# EAGLE design Braumister (EAGLE 5.11)
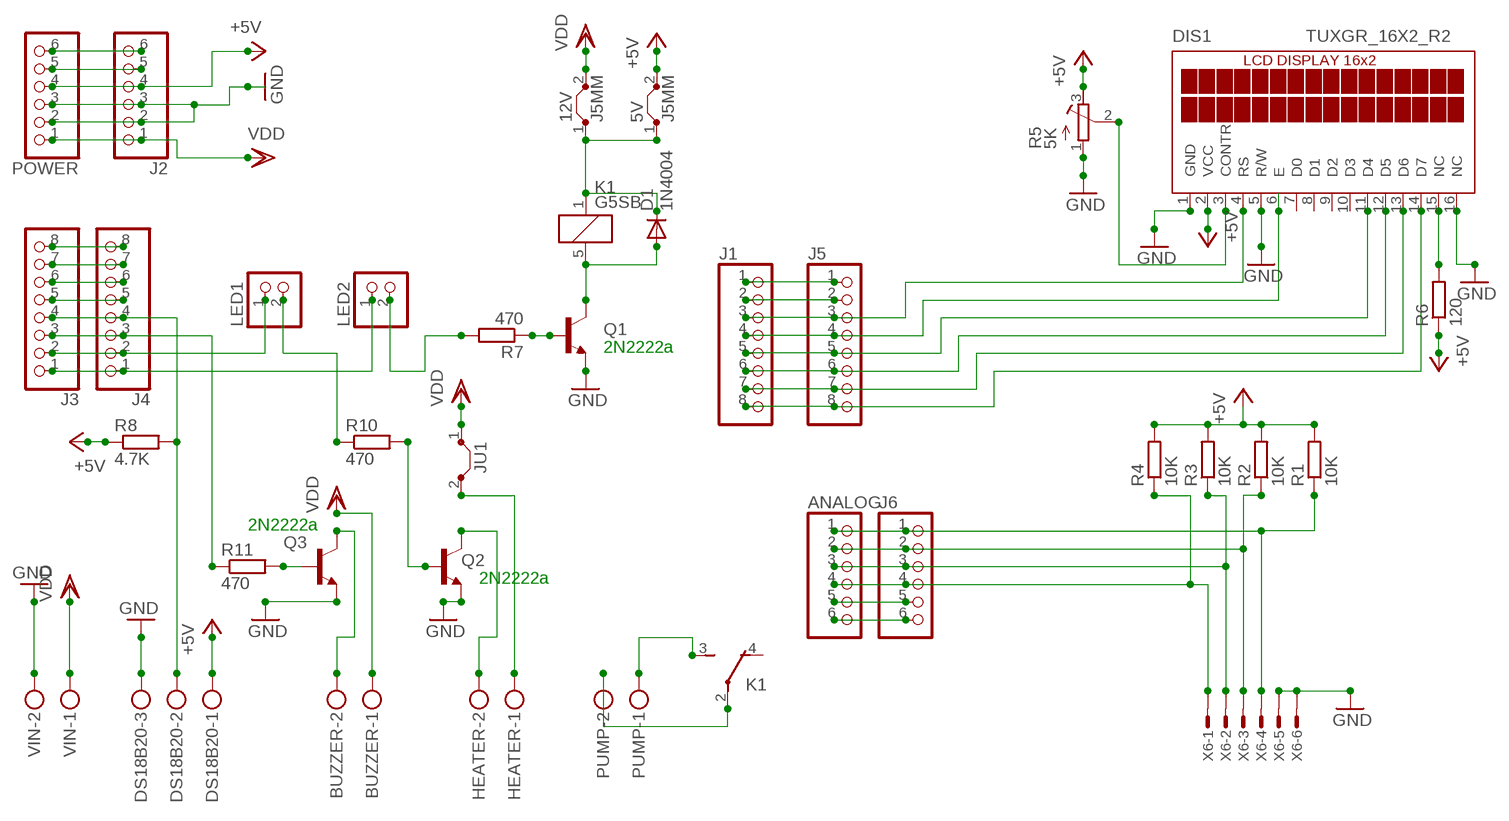
[diagram p0: schematic, sheet 1]

## Parts
5V  J5MM  [05]
12V  J5MM  [05]
ANALOG  PINHD-1X6NOVAULE  [1X06_NOVALUE]
BUZZER  MKDSN1,5/2-5,08  [MKDSN1,5/2-5,08]
D1  1N4004  [DO41-10]
DIS1  TUXGR_16X2_R2  [TUXGR_16X2_R2]
DS18B20  MKDSN1,5/3-5,08  [MKDSN1,5/3-5,08]
HEATER  MKDSN1,5/2-5,08  [MKDSN1,5/2-5,08]
J1  PINHD-1X8  [1X08]
J2  PINHD-1X6NOVAULE  [1X06_NOVALUE]
J3  PINHD-1X8  [1X08]
J4  PINHD-1X8  [1X08]
J5  PINHD-1X8  [1X08]
J6  PINHD-1X6  [1X06]
JU1  J10MM  [10]
K1  G5SB  [G5SB]
LED1  PINHD-1X2  [1X02]
LED2  PINHD-1X2  [1X02]
POWER  PINHD-1X6  [1X06]
PUMP  MKDSN1,5/2-5,08  [MKDSN1,5/2-5,08]
Q1  BC547  [TO92]
Q2  BC547  [TO92]
Q3  BC547  [TO92]
R1  10K  R-EU_0207/10  [0207/10]
R2  10K  R-EU_0207/10  [0207/10]
R3  10K  R-EU_0207/10  [0207/10]
R4  10K  R-EU_0207/10  [0207/10]
R5  5K  R-TRIMM3339P  [RTRIM3339P]
R6  120  R-EU_0207/10  [0207/10]
R7  470  R-EU_0207/10  [0207/10]
R8  4.7K  R-EU_0207/10  [0207/10]
R10  470  R-EU_0207/10  [0207/10]
R11  470  R-EU_0207/10  [0207/10]
VIN  MKDSN1,5/2-5,08  [MKDSN1,5/2-5,08]
X6  MICROMATCH-6  [MICROMATCH-6]

## Nets
+5V: 5V.2 DIS1.2(VCC) DS18B20.1 J2.4 POWER.4 R1.2 R2.2 R3.2 R4.2 R5.3(A) R6.1 R8.1
GND: DIS1.1(GND) DIS1.5(R/W) DIS1.16(NC) DS18B20.3 J2.2 J2.3 POWER.2 POWER.3 Q1.1(E) Q2.1(E) Q3.1(E) R5.1(E) VIN.2 X6.5 X6.6
N$1: J3.1 J4.1 LED2.1
N$2: J3.5 J4.5
N$3: ANALOG.1 J6.1 R1.1 X6.4
N$4: HEATER.2 Q2.3(C)
N$5: DS18B20.2 J3.4 J4.4 R8.2
N$6: J3.2 J4.2 LED1.1
N$7: J3.3 J4.3 R11.1
N$8: J1.1 J5.1
N$9: J1.2 J5.2
N$10: DIS1.4(RS) J1.3 J5.3
N$11: DIS1.6(E) J1.4 J5.4
N$12: DIS1.11(D4) J1.5 J5.5
N$13: DIS1.12(D5) J1.6 J5.6
N$14: DIS1.13(D6) J1.7 J5.7
N$15: DIS1.14(D7) J1.8 J5.8
N$16: ANALOG.2 J6.2 R2.1 X6.3
N$17: J3.6 J4.6
N$18: ANALOG.3 J6.3 R3.1 X6.2
N$19: ANALOG.4 J6.4 R4.1 X6.1
N$20: ANALOG.5 J6.5
N$21: ANALOG.6 J6.6
N$22: J3.7 J4.7
N$23: J3.8 J4.8
N$24: J2.5 POWER.5
N$25: J2.6 POWER.6
N$26: 5V.1 12V.1 D1.C K1.1
N$35: DIS1.3(CONTR) R5.2(S)
N$36: DIS1.15(NC) R6.2
N$38: K1.3(U:S) PUMP.1
N$39: K1.2(U:P) PUMP.2
N$40: D1.A K1.5 Q1.3(C)
N$43: Q1.2(B) R7.1
N$44: LED2.2 R7.2
N$45: HEATER.1 JU1.2
N$46: Q3.2(B) R11.2
N$47: BUZZER.2 Q3.3(C)
N$49: Q2.2(B) R10.2
N$50: LED1.2 R10.1
VDD: 12V.2 BUZZER.1 J2.1 JU1.1 POWER.1 VIN.1
Unconnected: DIS1.7(D0) DIS1.8(D1) DIS1.9(D2) DIS1.10(D3) K1.4(U:O)

## Notes on the sheet
- 2N2222a
- 2N2222a
- 2N2222a

## Library data of the parts
5V 12V JU1 = jumper:J: Bridge
ANALOG J2 J6 POWER = pinhead_arduino:PINHD-1X6: PIN HEADER
BUZZER HEATER PUMP VIN = con-phoenix-508:MKDSN1,5/2-5,08: MKDSN 1,5/ 2-5,08 Printklemme Nennstrom: 13,5 A Nennspannung: 250 V Rastermaß: 5,08 mm Polzahl: 2 Anschlussart: Schraubanschluss Montage: Löten Anschlussrichtung Leiter/Platine: 0 ° Artikelnummer: 1729128 Source: http://eshop.phoenixcontact.com .. 1729128.pdf; MPN: MKDSN 1,5/2-5.08; OC_FARNELL: 1792903; OC_NEWARK: 30M2397
D1 = diode:1N4004: DIODE general purpose rectifier, 1 A
DIS1 = display-lcd:TUXGR_16X2_R2: Tuxgraphics LCD display 16x2 characters reflective, without background light Source: tuxgr_12x2_r2.pdf; OC_FARNELL: unknown; OC_NEWARK: unknown
DS18B20 = con-phoenix-508:MKDSN1,5/3-5,08: MKDSN 1,5/ 3-5,08 Printklemme Nennstrom: 13,5 A Nennspannung: 250 V Rastermaß: 5,08 mm Polzahl: 3 Anschlussart: Schraubanschluss Montage: Löten Anschlussrichtung Leiter/Platine: 0 ° Artikelnummer: 1729131 Source: http://eshop.phoenixcontact.com .. 1729131.pdf; MPN: SMKDSN1,5/3-5,08; OC_FARNELL: 1792904; OC_NEWARK: 70R0299
J1 J3-J5 = pinhead_arduino:PINHD-1X8: PIN HEADER
K1 = relay_arduino:G5SB: Compact Single-pole Relay for Switching 5 A Source: http://www.omron.com/ecb/products/pry/121/g5sb.html; OC_FARNELL: unknown; OC_NEWARK: unknown
LED1 LED2 = pinhead_arduino:PINHD-1X2: PIN HEADER
Q1-Q3 = transistor-npn:BC547*: NPN Transistor
R1-R4 R6-R8 R10 R11 = rcl:R-EU_: RESISTOR, European symbol
R5 = rcl:R-TRIMM: Trimm resistor
X6 = con-amp-micromatch1:MICROMATCH-6: MicroMaTch 6 7-215464-6 / 0-215464-6 Drawing Number C-215464 DDEController.pdf

## Board
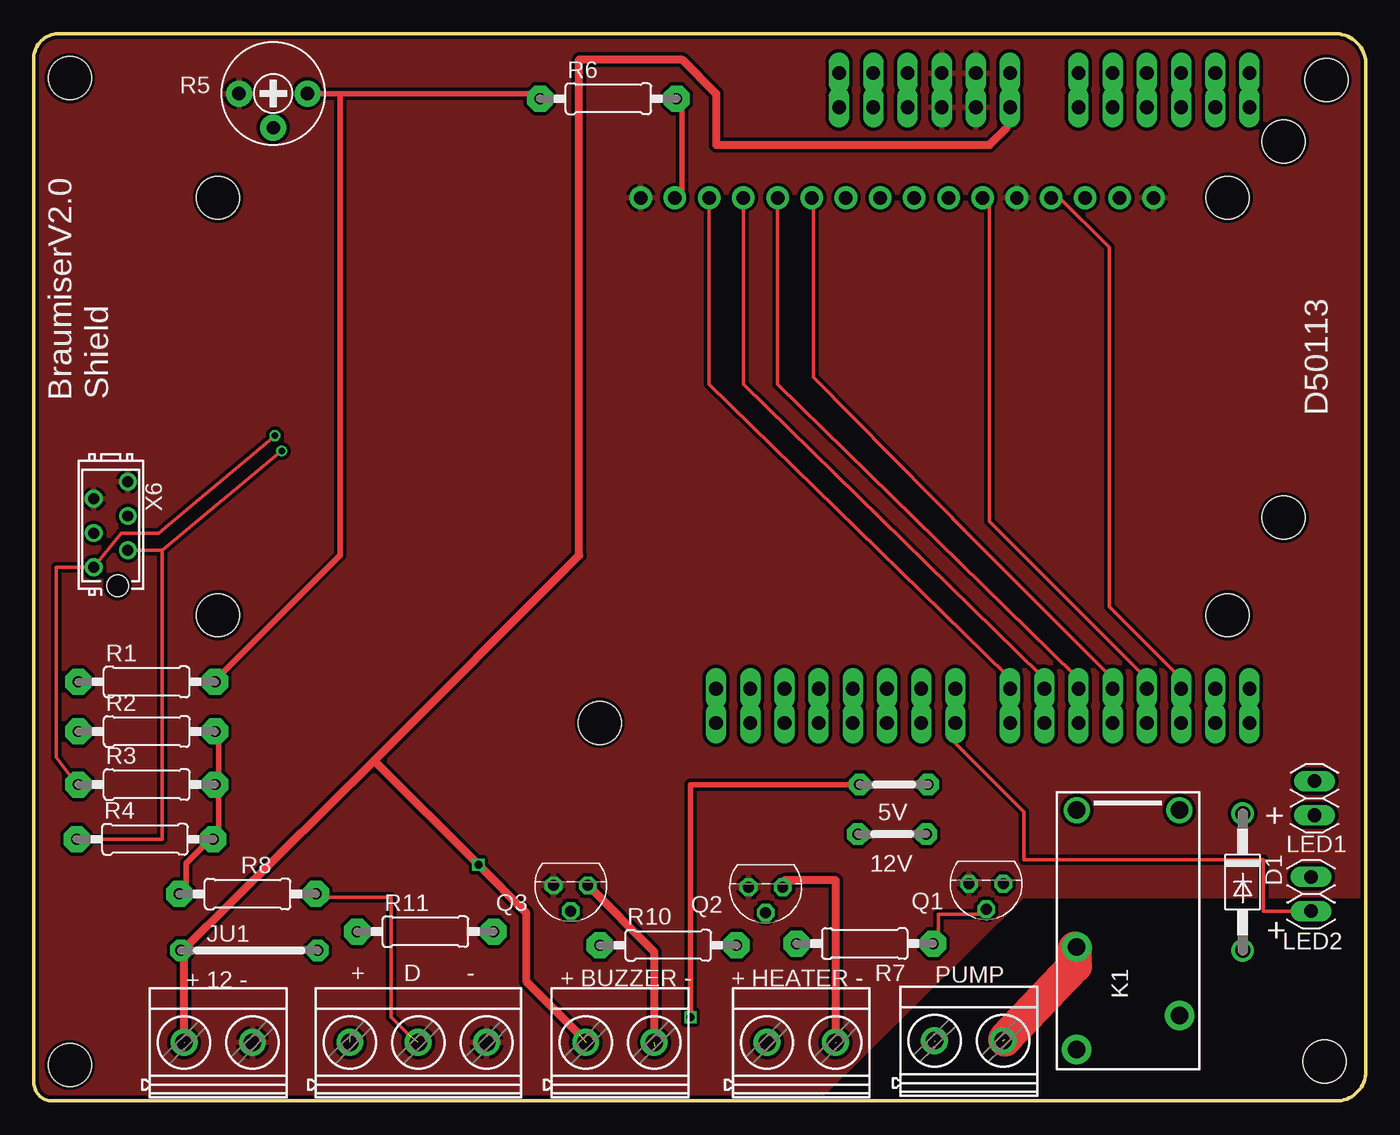
[diagram p1: board, top side]
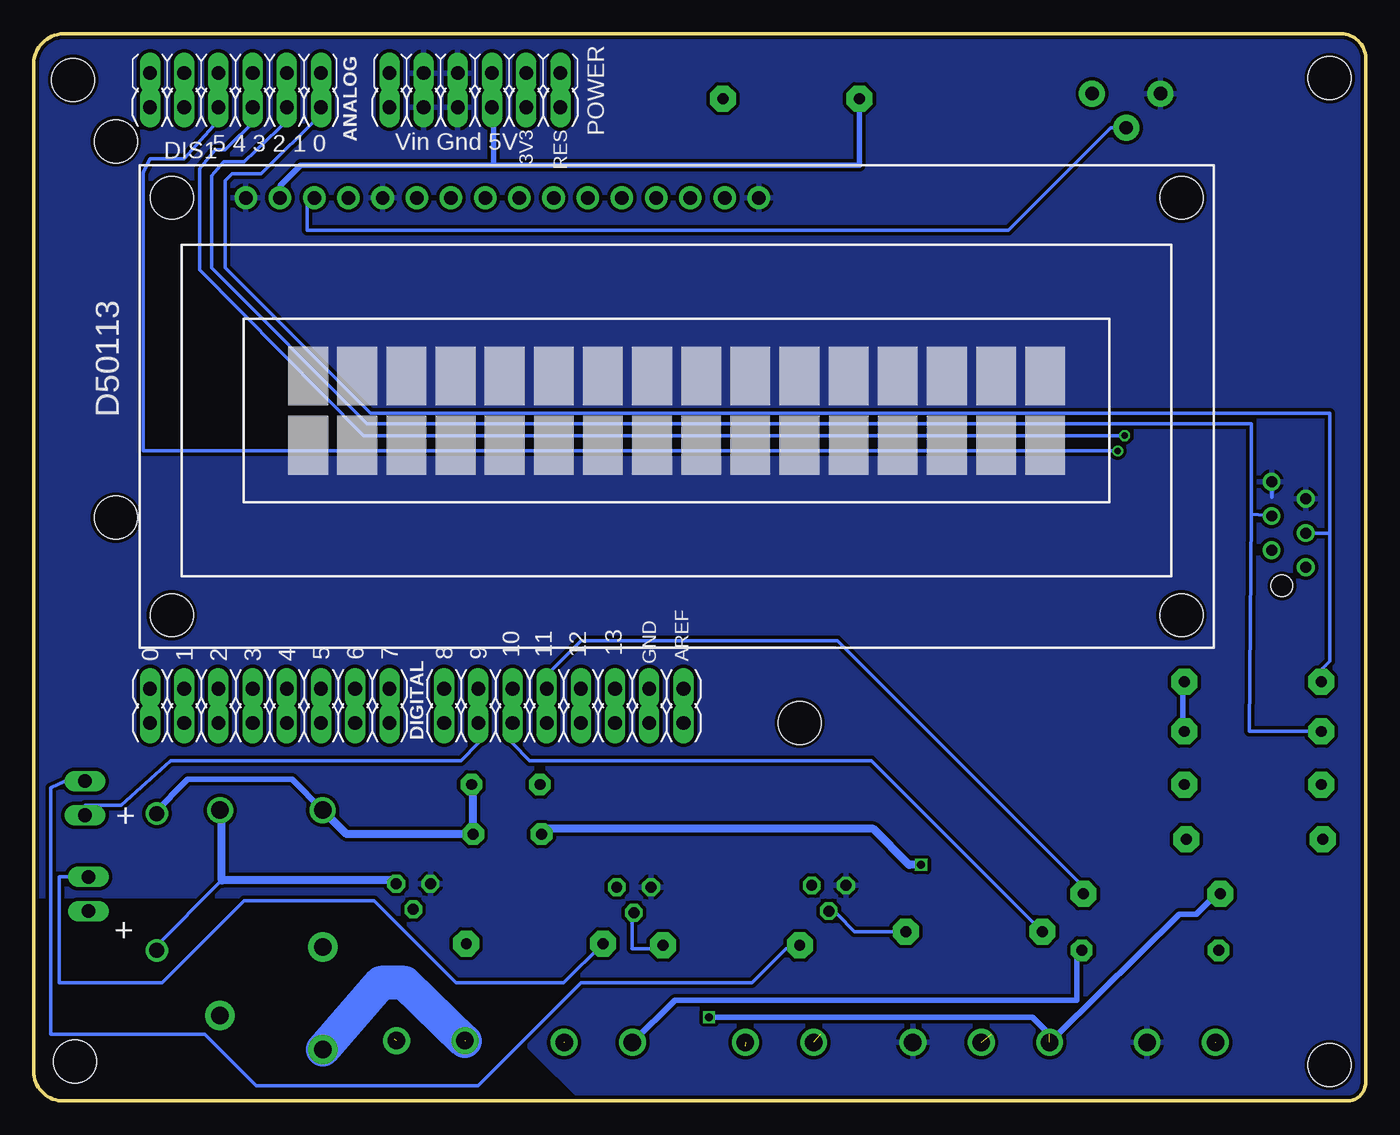
[diagram p2: board, bottom side, seen from below]

Size 98.96 x 79.25 mm. Coordinates in mm from the lower left corner, seen from the top.
Outline: 1.65,79.25 arc90 0.02,77.11 0.02,1.26 arc90 1.52,0.01 96.93,0.01 arc90 98.95,2.4 98.95,76.84 arc90 96.79,79.25 1.67,79.25
Copper layers (1*16): Top 0.035mm / dielectric 1.5mm / Bottom 0.035mm
Design rules "Fusion_eagle_rule_v1.1 *": minimum track width 6mil, minimum drill 12mil, track to track 10mil, track to pad 10mil, pad to pad 10mil, via to via 10mil, smd to smd 0mil, copper to edge 10mil, drill to drill 10mil, minimum pad ring 10mil, minimum via ring 6mil, stop-mask expansion 2mil, vias tented up to drill 100mil, thermal gap 10mil
Holes 3.2 mm at 42.05,28.07 92.85,71.25 92.85,43.31 2.68,75.95 96.03,75.82 2.68,2.67 95.9,2.93

### Footprints (pad centres in the part's own frame; a part is rotated, then mirrored left to right if it is on the bottom)
05 = drill 0.813 pad 1.6 octagon: 1 -2.54,0; 2 2.54,0
1X06_NOVALUE = drill 1.016 long: 1 -6.35,0; 2 -3.81,0; 3 -1.27,0; 4 1.27,0; 5 3.81,0; 6 6.35,0
MKDSN1,5/2-5,08 = drill 1.3 pad 2 round: 1 -2.561,0.025; 2 2.519,0.025
DO41-10 = drill 1.118 round: A 5.08,0; C -5.08,0
TUXGR_16X2_R2 = drill 1 pad 1.676 round: 1 -32,15.5; 2 -29.46,15.5; 3 -26.92,15.5; 4 -24.38,15.5; 5 -21.84,15.5; 6 -19.3,15.5; 7 -16.76,15.5; 8 -14.22,15.5; 9 -11.68,15.5; 10 -9.14,15.5; 11 -6.6,15.5; 12 -4.06,15.5; 13 -1.52,15.5; 14 1.02,15.5; 15 3.56,15.5; 16 6.1,15.5 | hole 3.2: -37.5,-15.5; 37.5,-15.5; -37.5,15.5; 37.5,15.5
MKDSN1,5/3-5,08 = drill 1.3 pad 2 round: 1 -7.641,0.025; 2 -2.561,0.025; 3 2.519,0.025
1X08 = drill 1.016 long: 1 -8.89,0; 2 -6.35,0; 3 -3.81,0; 4 -1.27,0; 5 1.27,0; 6 3.81,0; 7 6.35,0; 8 8.89,0
1X06 = drill 1.016 long: 1 -6.35,0; 2 -3.81,0; 3 -1.27,0; 4 1.27,0; 5 3.81,0; 6 6.35,0
10 = drill 0.813 pad 1.6 octagon: 1 -5.08,0; 2 5.08,0
G5SB = drill 1.3 pad 1.93 round: 1 7.62,3.81; 5 7.62,-3.81 | drill 1.3 pad 2.184 round: 2 -2.54,3.81; 3 -10.16,3.81; 4 -7.62,-3.81
1X02 = drill 1.016 long: 1 -1.27,0; 2 1.27,0
TO92 = drill 0.813 octagon: 1 1.27,0; 2 0,1.905; 3 -1.27,0
0207/10 = drill 0.813 pad 1.93 octagon: 1 -5.08,0; 2 5.08,0
RTRIM3339P = drill 1 pad 1.93 round: 1 -2.54,0; 2 0,-2.54; 3 2.54,0
MICROMATCH-6 = drill 0.813 round: 1 1.905,1.27; 2 3.175,-1.27; 3 -0.635,1.27; 4 0.635,-1.27; 5 -3.175,1.27; 6 -1.905,-1.27 | hole 1.6: 4.55,0.5

### Placement (x,y rotation side)
5V  63.9,23.5 180 top
12V  63.77,19.82 180 top
ANALOG  83.96,76.33 180 bottom
BUZZER  43.58,4.32 0 top
D1  89.8,16.26 270 top
DIS1  51.2,51.57 0 bottom
DS18B20  31.13,4.32 0 top
HEATER  57.04,4.32 0 top
J1  81.42,28.07 0 bottom
J2  66.18,76.33 0 bottom
J3  59.58,28.07 0 bottom
J4  59.58,30.61 0 bottom
J5  81.42,30.61 0 bottom
J6  83.96,73.79 180 bottom
JU1  16.02,11.18 0 top
K1  81.3,13.98 90 top
LED1  95.14,22.48 90 top
LED2  94.88,15.37 90 top
POWER  66.18,73.79 0 bottom
PUMP  69.48,4.45 0 top
Q1  70.75,16.13 180 top
Q2  54.37,15.88 180 top
Q3  39.89,16.01 180 top
R1  8.4,31.12 0 top
R2  8.4,27.44 0 top
R3  8.4,23.5 0 top
R4  8.27,19.44 0 top
R5  17.8,74.81 0 top
R6  42.69,74.43 0 top
R7  61.74,11.69 180 top
R8  15.89,15.37 0 top
R10  47.13,11.56 0 top
R11  29.1,12.58 0 top
VIN  13.73,4.32 0 top
X6  5.73,42.8 270 top

### Tracks (layer width: path | path; a pad name or v marks a point on that pad's centre or on a via)
+5V  (via drill 0.6)  (1 unrouted)
  Top 0.254: R8.1 11.32,15.12 | 13.73,22.87 R3.2 13.73,24.01 | 12.59,18.93 R4.2 | 13.73,26.55 R2.2 | 36.72,74.81 R6.1 | R5.3 20.21,74.81 | R1.2 13.86,31.63
  Top 0.406: 11.32,15.12 11.32,17.66 12.59,18.93 13.73,19.69 13.73,22.87 | 13.73,24.01 13.73,26.55 | 22.75,74.81 R5.3 | 22.75,74.81 36.72,74.81 | 13.86,31.63 22.75,40.52 22.75,74.81 | v48.78,6.23 48.78,23.5 5V.2
  Bottom 0.254: 13.6,30.49 13.86,30.36 R1.2 | R2.2 13.6,27.95 | R8.1 11.32,15.12 | 64.66,74.81 64.66,76.08 J2.4 | 64.66,74.81 POWER.4 64.79,73.67 64.79,69.6 64.91,69.47 | 80.66,67.95 DIS1.2 | 64.79,74.81 64.66,74.81
  Bottom 0.406: 13.6,27.95 13.6,30.49 | 11.32,15.12 12.59,13.85 13.86,13.85 22.88,4.96 23.51,4.96 24.78,6.23 v48.78,6.23 | 80.66,67.95 79.14,69.47 64.91,69.47 | 64.79,74.81 64.79,69.47 37.61,69.47 R6.1
GND
  Bottom 0.254: 7,44.84 X6.5
  pour Top: 8.14,79.51 98.82,79.51 98.82,15.25 73.42,15.25 58.05,0.01 -0.11,0.01 -0.11,79.38 8.14,79.38
  pour Bottom: 7.38,79.13 98.82,79.38 98.82,15.25 73.42,15.25 58.05,0.01 0.02,0.01 0.02,79.25 7.38,79.25
N$1
  Top 0.254: J4.1 J3.1 68.47,26.55 73.55,21.47 73.55,17.91 91.33,17.91 91.33,14.1 LED2.1
N$2
  Top 0.254: J3.5 J4.5
N$3
  Top 0.254: J6.1 77.36,74.81 77.36,76.08 ANALOG.1
  Bottom 0.254: R1.1 3.32,32.01 2.68,32.64 2.68,42.17 | 2.68,42.17 X6.4 | 2.68,42.17 2.68,51.06 73.93,51.06 84.72,61.85 84.72,68.33 84.22,68.84 82.06,68.84 77.61,73.28 J6.1
N$4  (1 unrouted)
  Top 0.254: 55.77,16.39 Q2.3 | 59.58,4.32 59.58,4.96
  Top 0.61: 55.77,16.39 59.58,16.39 59.58,4.96
N$5  (1 unrouted)
  Top 0.254: J4.4 J3.4 | 27.83,4.96 26.56,6.23 26.56,15.12 21.48,15.12 R8.2
  Bottom 0.254: J4.4 60.85,31.63 58.31,34.17 39.26,34.17 20.21,15.12 R8.2
N$6
  Top 0.254: J3.2 J4.2
  Bottom 0.254: LED1.1 95.14,21.98 92.47,21.98 88.79,25.28 67.2,25.28 65.93,26.55 J3.2
N$7
  Top 0.254: J3.3 J4.3
  Bottom 0.254: R11.1 36.72,25.28 62.12,25.28 63.39,26.55 J3.3
N$8
  Top 0.254: J1.1 90.06,29.09 90.06,30.36 J5.1
N$9
  Top 0.254: J1.2 87.52,29.09 87.52,30.36 J5.2
N$10
  Top 0.254: J1.3 84.98,29.09 84.98,30.36 J5.3 84.98,31.63 79.9,36.71 79.9,63.38 76.09,67.19 DIS1.4
N$11
  Top 0.254: J1.4 82.44,29.09 82.44,30.36 J5.4 82.44,31.63 71.01,43.06 71.01,67.19 DIS1.6
N$12
  Top 0.254: J1.5 79.9,29.09 79.9,30.36 J5.5 79.9,31.63 69.74,41.79 57.93,53.73 57.93,67.19 DIS1.11
N$13
  Top 0.254: J1.6 77.36,29.09 77.36,30.36 J5.6 77.36,31.63 55.26,53.22 55.26,67.19 DIS1.12
N$14
  Top 0.254: J1.7 74.82,29.09 74.82,30.36 J5.7 74.82,31.63 52.72,53.22 52.72,67.19 DIS1.13
N$15
  Top 0.254: J1.8 72.28,29.09 72.28,30.36 J5.8 72.28,31.63 50.18,53.22 50.18,67.19 DIS1.14
N$16
  Top 0.254: J6.2 79.9,74.81 79.9,76.08 ANALOG.2
  Bottom 0.254: R2.1 8.65,27.44 8.52,43.57 | 8.52,43.57 X6.3 | 8.52,43.57 8.52,50.3 74.18,50.3 85.74,61.85 85.74,68.71 84.85,69.73 83.33,69.73 80.03,72.9 80.03,73.67 J6.2
N$17
  Top 0.254: J3.6 J4.6
N$18  (via drill 0.5)
  Top 0.254: ANALOG.3 82.44,76.08 82.44,74.81 J6.3 83.07,73.41 | R3.1 3.7,22.74 3.7,22.87 1.67,25.53 1.67,39.63 X6.2 6.49,42.17 9.29,42.17 10.05,42.8 v17.92,49.41
  Bottom 0.254: v17.92,49.41 74.44,49.41 86.63,61.73 86.63,69.22 85.49,70.62 84.72,70.62 82.44,72.9 82.44,73.54 J6.3
N$19  (via drill 0.5)
  Top 0.254: J6.4 84.98,74.81 84.98,76.08 ANALOG.4 | R4.1 9.54,19.44 9.54,40.9 | 9.54,40.9 X6.1 | 9.54,40.9 v18.43,48.27
  Bottom 0.254: J6.4 85.61,72.4 87.77,69.98 90.31,69.98 90.82,68.97 90.82,48.27 v18.43,48.27
N$20
  Top 0.254: J6.5 87.52,74.81 87.52,76.08 ANALOG.5
N$21
  Top 0.254: J6.6 90.06,74.81 90.06,76.08 ANALOG.6
N$22
  Top 0.254: J3.7 J4.7
N$23
  Top 0.254: J3.8 J4.8
N$24
  Top 0.254: POWER.5 62.12,74.81 62.12,76.08 J2.5
N$25
  Top 0.254: POWER.6 59.58,74.81 59.58,76.08 J2.6
N$26
  Bottom 0.406: D1.C 90.06,21.34 87.52,23.88 79.77,23.88 K1.1
  Bottom 0.61: K1.1 75.71,19.82 12V.1 66.31,23.37 5V.1
N$35
  Bottom 0.254: DIS1.3 78.63,67.19 78.63,64.65 26.56,64.65 18.94,72.27 R5.2 17.67,72.27
N$36
  Top 0.254: DIS1.15 48.15,67.19 | 48.15,73.54 R6.2
  Top 0.406: 48.15,67.19 48.15,73.54
N$38  (1 unrouted)
  Bottom 2.54: 66.94,4.45 71.39,8.77 73.17,8.77 K1.3
N$39  (1 unrouted)
  Top 0.254: 77.36,11.31 K1.2
  Top 2.54: 72.15,4.58 77.36,10.04 77.36,11.31
N$40
  Bottom 0.254: 84.98,16.39 90.06,11.31 D1.A | Q1.3 72.28,16.39 | 84.98,21.47 K1.5
  Bottom 0.61: 72.28,16.39 84.98,16.39 84.98,21.47
N$43
  Top 0.254: Q1.2 71.01,13.85 67.2,13.85 67.2,12.58 R7.1
N$44
  Bottom 0.254: LED2.2 97.04,16.64 97.04,8.77 89.42,8.77 83.33,14.86 73.68,14.86 67.58,8.77 59.58,8.77 R7.2
N$45
  Bottom 0.254: 21.48,11.31 JU1.2
  Bottom 0.406: 21.48,11.31 21.48,7.5 51.33,7.5 HEATER.1
N$46
  Bottom 0.254: R11.2 37.99,12.58 39.26,13.85 Q3.2
N$47  (1 unrouted)
  Top 0.61: 46.12,4.07 46.12,11.05 Q3.3
N$49
  Bottom 0.254: Q2.2 54.5,13.85 54.5,11.31 51.96,11.31 R10.2
N$50
  Bottom 0.254: LED1.2 96.66,23.75 97.68,23.25 97.68,4.96 86.25,4.96 82.44,1.15 65.93,1.15 58.31,8.77 45.61,8.77 43.07,11.31 41.8,11.31 R10.1
VDD  (via drill 0.6)  (2 unrouted)
  Top 0.254: J2.1 72.28,76.08 72.28,74.81 POWER.1 72.28,73.54 72.28,72.27 | 11.19,11.31 JU1.1
  Top 0.61: 11.19,4.32 11.19,11.31 25.29,25.28 | 72.28,72.27 71.01,71 50.69,71 50.69,74.81 48.15,77.35 40.53,77.35 40.53,40.52 25.29,25.28 | 40.53,4.96 36.59,8.9 36.59,13.98 v33.04,17.53 25.29,25.28
  Bottom 0.61: v33.04,17.53 33.92,17.53 36.59,20.2 60.85,20.2 12V.2

### Text on the board
tPlace: Shield | BraumiserV2.0 | D50113 | + | +
bPlace: D50113 | 13 | 12 | 11 | 10 | 9 | 8 | 7 | 6 | 5 | 4 | 3 | 2 | 1 | 0 | + | +
tNames: + 12 - | + D - | + BUZZER - | + HEATER - | PUMP
bNames: RES | Vin Gnd 5V | 3V3 | 5 4 3 2 1 0 | GND | AREF | DIGITAL
tStop: ANALOG | 0 | 5 | VIN | RST | 3.3V | 5V | GND | GND | 13 | 12 | 11 | 10 | 9 | 8 | 0 | DIGITAL | GND | 7 | AREF